# EasyEDA schematic A-skin.json
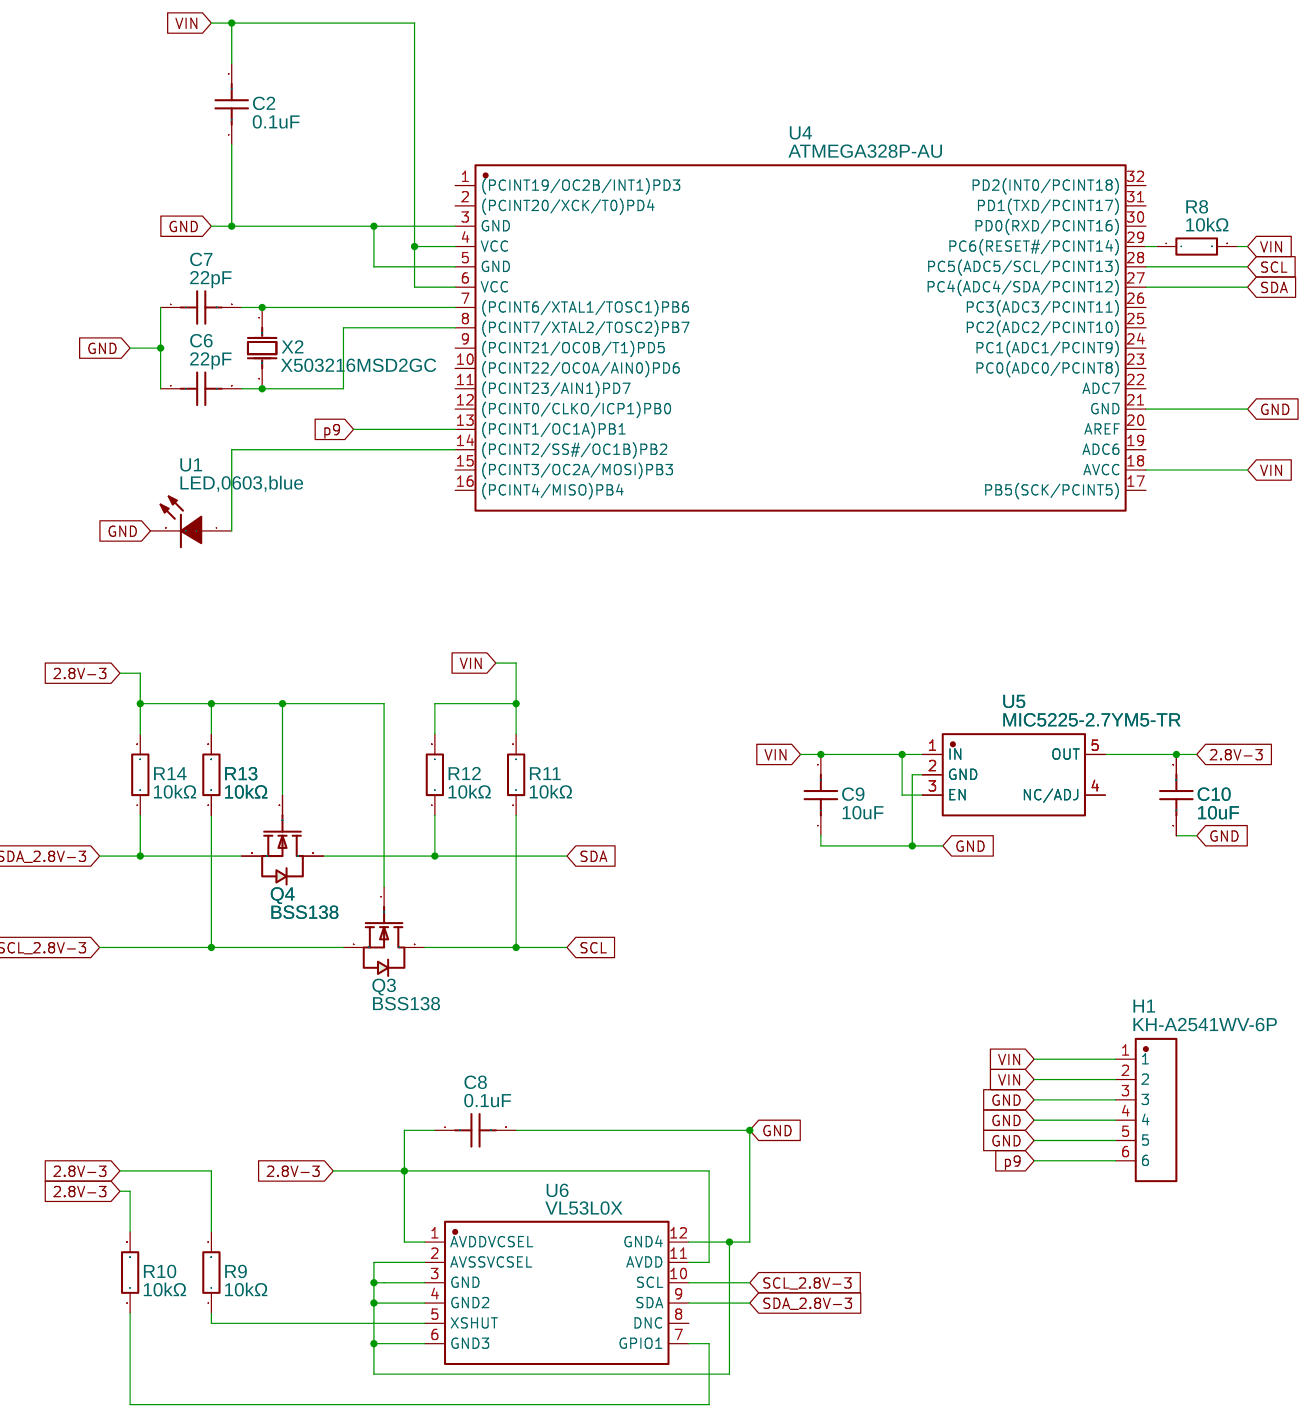
[diagram p0: schematic sheet]

## Parts
C2  0.1uF  [C0603]
C6  22pF  [C0603]
C7  22pF  [C0603]
C8  0.1uF  [C0603]
C9  10uF  [C0805]
C10  10uF  [C0805]
H1  KH-A2541WV-6P  [HDR-TH_6P-P2.54-V-M]
Q3  BSS138  [SOT-23-3_L2.9-W1.3-P1.90-LS2.4-BR]
Q4  BSS138  [SOT-23-3_L2.9-W1.3-P1.90-LS2.4-BR]
R8  10kΩ  [R0603]
R9  10kΩ  [R0603]
R10  10kΩ  [R0603]
R11  10kΩ  [R0603]
R12  10kΩ  [R0603]
R13  10kΩ  [R0603]
R14  10kΩ  [R0603]
U1  LED,0603,blue  [LED0603-R-RD_BLUE]
U4  ATMEGA328P-AU  [TQFP-32_L7.0-W7.0-P0.80-LS9.0-BL]
U5  MIC5225-2.7YM5-TR  [SOT-23-5_L2.9-W1.6-P0.95-LS2.8-BR]
U6  VL53L0X  [LGA-12_L4.4-W2.4_VL53L0X]
X2  X503216MSD2GC  [OSC-SMD_L5.0-W3.2]

## Library data of the parts
C2 C8 = 0603BB104K500NGT: Supplier: LCSC; Supplier Part: C2168571; Manufacturer: Knowles(楼氏); Contributor: LCSC; JLCPCB Part Class: Extended Part
C6 C7 = C0603C220J5GACAUTO: Supplier: LCSC; Supplier Part: C599692; Manufacturer: KEMET(基美); Contributor: LCSC; JLCPCB Part Class: Extended Part
C9 C10 = GRM21BR71A106KA73L: Supplier: LCSC; Supplier Part: C117956; Manufacturer: muRata(村田); Contributor: LCSC; JLCPCB Part Class: Extended Part
H1 = KH-A2541WV-6P: Supplier: LCSC; Supplier Part: C2833331; Manufacturer: kinghelm(金航标); Contributor: LCSC; JLCPCB Part Class: Extended Part
Q3 Q4 = BSS138: Supplier: LCSC; Manufacturer: CJ(江苏长电/长晶); Supplier Part: C78284; JLCPCB Part Class: Extended Part
R8-R14 = ETCR0603F10K0K9: Supplier: LCSC; Supplier Part: C365375; Manufacturer: RESI(开步睿思）; Resistance (Ohms): 10K; Contributor: LCSC; JLCPCB Part Class: Extended Part
U1 = LED灯,0603,蓝色: Contributor: LCSC; Supplier: LCSC; Supplier Part: C9900011154; Manufacturer: null; JLCPCB Part Class: Extended Part
U4 = ATMEGA328P-AU: Supplier: LCSC; Manufacturer: MICROCHIP(美国微芯); Supplier Part: C14877; JLCPCB Part Class: Basic Part
U5 = MIC5225-2.7YM5-TR: Supplier: LCSC; Supplier Part: C625863; Manufacturer: MICROCHIP(美国微芯); link: https://atta.szlcsc.comnull; Contributor: lcsc
U6 = VL53L0X: Supplier: LCSC; Supplier Part: C2929940; JLCPCB Part Class: Extended Part; Contributor: LCSC; Manufacturer: null
X2 = X503216MSD2GC: Supplier Part: C49231; Supplier: LCSC; Manufacturer: YXC; JLCPCB Part Class: Extended Part

## Nets
2.8V-3: C8.1 C10.2 Q3.1(G) Q4.1(G) R9.2 R10.2 R13.2 R14.2 U5.5(OUT) U6.1(AVDDVCSEL) U6.11(AVDD)
GND: C2.1 C6.1 C7.1 C8.2 C9.1 C10.1 H1.3 H1.4 H1.5 U1.2(K) U4.3(GND) U4.5(GND) U4.21(GND) U5.2(GND) U6.2(AVSSVCSEL) U6.3(GND) U6.4(GND2) U6.6(GND3) U6.12(GND4)
VIN: C2.2 C9.2 H1.1 H1.2 R8.2 R11.2 R12.2 U4.4(VCC) U4.6(VCC) U4.18(AVCC) U5.1(IN) U5.3(EN)
p9: H1.6 U4.13((PCINT1/OC1A)PB1)
SCL: Q3.3(D) R11.1 U4.28(PC5(ADC5/SCL/PCINT13))
SCL_2.8V-3: Q3.2(S) R13.1 U6.10(SCL)
SDA: Q4.3(D) R12.1 U4.27(PC4(ADC4/SDA/PCINT12))
SDA_2.8V-3: Q4.2(S) R14.1 U6.9(SDA)
Net-(C6-2): C6.2 U4.8((PCINT7/XTAL2/TOSC2)PB7) X2.2(OSC2)
Net-(C7-2): C7.2 U4.7((PCINT6/XTAL1/TOSC1)PB6) X2.1(OSC1)
Net-(R8-1): R8.1 U4.29(PC6(RESET#/PCINT14))
Net-(R9-1): R9.1 U6.5(XSHUT)
Net-(R10-1): R10.1 U6.7(GPIO1)
Net-(U1-1): U1.1(A) U4.14((PCINT2/SS#/OC1B)PB2)

Not connected (* = marked no-connect by the designer): U4 1((PCINT19/OC2B/INT1)PD3) 2((PCINT20/XCK/T0)PD4) 9((PCINT21/OC0B/T1)PD5) 10((PCINT22/OC0A/AIN0)PD6) 11((PCINT23/AIN1)PD7) 12((PCINT0/CLKO/ICP1)PB0) 15((PCINT3/OC2A/MOSI)PB3) 16((PCINT4/MISO)PB4) 17(PB5(SCK/PCINT5)) 19(ADC6) 20(AREF) 22(ADC7) 23(PC0(ADC0/PCINT8)) 24(PC1(ADC1/PCINT9)) 25(PC2(ADC2/PCINT10)) 26(PC3(ADC3/PCINT11)) 30(PD0(RXD/PCINT16)) 31(PD1(TXD/PCINT17)) 32(PD2(INT0/PCINT18)); U5 4(NC/ADJ); U6 8(DNC)
